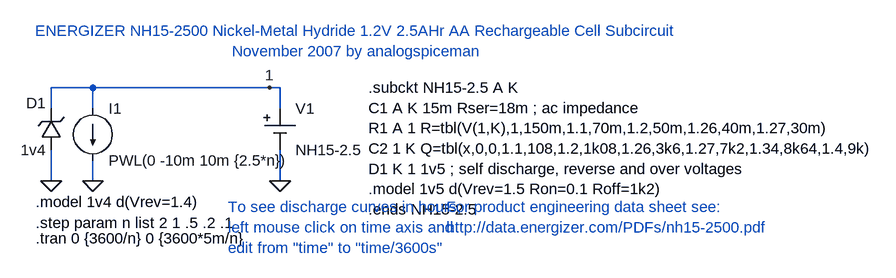
[diagram p0: schematic NHcell.asc]
NHcell.asc, the LTspice schematic file:
Version 4
SHEET 1 1428 680
WIRE -144 144 -208 144
WIRE 128 144 -144 144
WIRE 144 144 128 144
WIRE -208 176 -208 144
WIRE -144 176 -144 144
WIRE 144 176 144 144
WIRE -208 288 -208 240
WIRE -144 288 -144 256
WIRE 144 288 144 240
FLAG -144 288 0
FLAG 144 288 0
FLAG -208 288 0
FLAG 128 144 1
SYMBOL zener -192 240 R180
WINDOW 0 24 72 Left 0
WINDOW 3 24 0 Left 0
SYMATTR InstName D1
SYMATTR Value 1v4
SYMBOL current -144 176 R0
WINDOW 123 0 0 Left 0
WINDOW 39 0 0 Left 0
SYMATTR InstName I1
SYMATTR Value PWL(0 -10m 10m {2.5*n})
SYMBOL Misc\\cell 144 176 R0
SYMATTR InstName V1
SYMATTR Value NH15-2.5
SYMATTR Prefix X
TEXT -232 320 Left 0 !.model 1v4 d(Vrev=1.4)
TEXT -232 352 Left 0 !.step param n list 2 1 .5 .2 .1
TEXT -232 376 Left 0 !.tran 0 {3600/n} 0 {3600*5m/n}
TEXT 280 144 Left 0 !.subckt NH15-2.5 A K\nC1 A K 15m Rser=18m ; ac impedance\nR1 A 1 R=tbl(V(1,K),1,150m,1.1,70m,1.2,50m,1.26,40m,1.27,30m)\nC2 1 K Q=tbl(x,0,0,1.1,108,1.2,1k08,1.26,3k6,1.27,7k2,1.34,8k64,1.4,9k)\nD1 K 1 1v5 ; self discharge, reverse and over voltages\n.model 1v5 d(Vrev=1.5 Ron=0.1 Roff=1k2)\n.ends NH15-2.5
TEXT 64 328 Left 0 ;To see discharge curves in hours, \nleft mouse click on time axis and\nedit from "time" to "time/3600s"
TEXT 264 72 Center 0 ;ENERGIZER NH15-2500 Nickel-Metal Hydride 1.2V 2.5AHr AA Rechargeable Cell Subcircuit\nNovember 2007 by analogspiceman
TEXT 400 328 Left 0 ;For product engineering data sheet see:\nhttp://data.energizer.com/PDFs/nh15-2500.pdf

The netlist it stands for:
* NHcell.asc
D1 0 1 1v4
I1 1 0 PWL(0 -10m 10m {2.5*n})
XV1 1 0 NH15-2.5  ; pins + -
.model D D
.lib standard.dio
.model 1v4 d(Vrev=1.4)
.step param n list 2 1 .5 .2 .1
.tran 0 {3600/n} 0 {3600*5m/n}
.subckt NH15-2.5 A K
C1 A K 15m Rser=18m ; ac impedance
R1 A 1 R=tbl(V(1,K),1,150m,1.1,70m,1.2,50m,1.26,40m,1.27,30m)
C2 1 K Q=tbl(x,0,0,1.1,108,1.2,1k08,1.26,3k6,1.27,7k2,1.34,8k64,1.4,9k)
D1 K 1 1v5 ; self discharge, reverse and over voltages
.model 1v5 d(Vrev=1.5 Ron=0.1 Roff=1k2)
.ends NH15-2.5
* To see discharge curves in hours,
* left mouse click on time axis and
* edit from "time" to "time/3600s"
* ENERGIZER NH15-2500 Nickel-Metal Hydride 1.2V 2.5AHr AA Rechargeable Cell Subcircuit
* November 2007 by analogspiceman
* For product engineering data sheet see:
* http://data.energizer.com/PDFs/nh15-2500.pdf
.backanno
.end